# Vivado block design design_3, xczu28dr-ffvg1517-2-e, Vivado 2021.1
# (continued, part 2 of 3)
current_bd_instance /tx1/fec_hier_tx1

create_bd_cell -type ip -vlnv xilinx.com:ip:axis_subset_converter:1.1 axis_subset_converter_2
set_property -dict [list \
  CONFIG.M_TDATA_NUM_BYTES 16 \
  CONFIG.S_TDATA_NUM_BYTES 4 \
  CONFIG.TDATA_REMAP {96'b000000000000000000000000000000000000000000000000000000000000000000000000000000000000000000000000,tdata[31:0]} \
  CONFIG.TKEEP_REMAP {1'b0} \
] [get_bd_cells axis_subset_converter_2]
create_bd_cell -type ip -vlnv xilinx.com:ip:axis_subset_converter:1.1 axis_subset_converter_3
set_property -dict [list \
  CONFIG.M_TDATA_NUM_BYTES 4 \
  CONFIG.S_TDATA_NUM_BYTES 16 \
  CONFIG.TDATA_REMAP {tdata[31:0]} \
  CONFIG.TKEEP_REMAP {1'b0} \
] [get_bd_cells axis_subset_converter_3]
create_bd_cell -type ip -vlnv xilinx.com:ip:sd_fec:1.1 sd_fec_0
set_property -dict [list \
  CONFIG.Build_SDK_Project true \
  CONFIG.DIN_Words 4 \
  CONFIG.DOUT_Words 4 \
  CONFIG.DRV_INITIALIZATION_PARAMS {{ 0x00000014,0x00000001,0x0000000C,0x00000000 }} \
  CONFIG.DRV_STANDARD 1 \
  CONFIG.DRV_TURBO_PARAMS undefined \
  CONFIG.Example_Design_PS_Type ZYNQ_UltraScale+_RFSoC \
  CONFIG.HDL_INITIALIZATION {{20 1 FEC_CODE} {12 0 AXIS_WIDTH}} \
  CONFIG.Include_Encoder true \
  CONFIG.Include_PS_Example_Design true \
  CONFIG.LDPC_Decode false \
  CONFIG.LDPC_Encode true \
  CONFIG.Parameter_Interface Initialized_retain_I/F \
  CONFIG.Standard 5G \
] [get_bd_cells sd_fec_0]
create_bd_cell -type ip -vlnv xilinx.com:ip:axis_broadcaster:1.1 axis_broadcaster_0
create_bd_cell -type ip -vlnv xilinx.com:user:fec_controller:1.0 fec_controller_0
set_property -dict {CONFIG.C_S00_AXIS_TDATA_WIDTH 32} [get_bd_cells fec_controller_0]

# ---- hierarchy /hier_sync_tx ----
current_bd_instance /hier_sync_tx
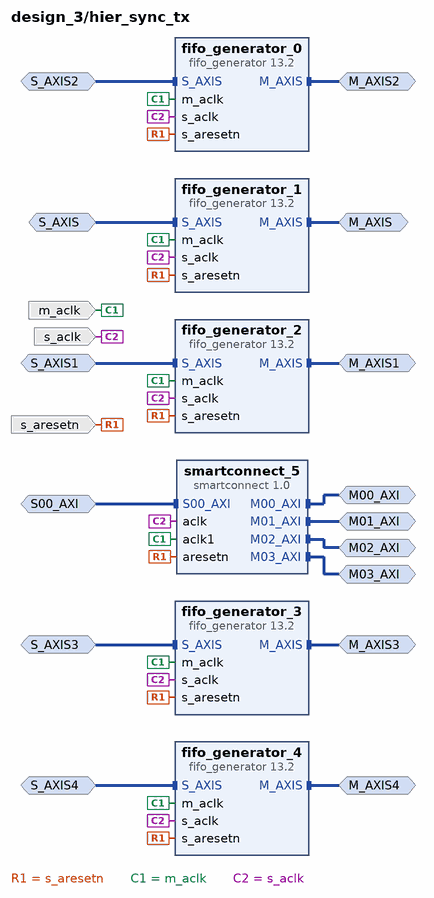
[diagram p15: block diagram inside /hier_sync_tx]
create_bd_intf_pin -mode Master -vlnv xilinx.com:interface:axis_rtl:1.0 M_AXIS
create_bd_intf_pin -mode Slave -vlnv xilinx.com:interface:axis_rtl:1.0 S_AXIS
create_bd_intf_pin -mode Master -vlnv xilinx.com:interface:axis_rtl:1.0 M_AXIS1
create_bd_intf_pin -mode Slave -vlnv xilinx.com:interface:axis_rtl:1.0 S_AXIS1
create_bd_intf_pin -mode Master -vlnv xilinx.com:interface:axis_rtl:1.0 M_AXIS2
create_bd_intf_pin -mode Slave -vlnv xilinx.com:interface:axis_rtl:1.0 S_AXIS2
create_bd_intf_pin -mode Slave -vlnv xilinx.com:interface:axis_rtl:1.0 S_AXIS3
create_bd_intf_pin -mode Slave -vlnv xilinx.com:interface:axis_rtl:1.0 S_AXIS4
create_bd_intf_pin -mode Master -vlnv xilinx.com:interface:axis_rtl:1.0 M_AXIS3
create_bd_intf_pin -mode Master -vlnv xilinx.com:interface:axis_rtl:1.0 M_AXIS4
create_bd_intf_pin -mode Slave -vlnv xilinx.com:interface:aximm_rtl:1.0 S00_AXI
create_bd_intf_pin -mode Master -vlnv xilinx.com:interface:aximm_rtl:1.0 M03_AXI
create_bd_intf_pin -mode Master -vlnv xilinx.com:interface:aximm_rtl:1.0 M00_AXI
create_bd_intf_pin -mode Master -vlnv xilinx.com:interface:aximm_rtl:1.0 M01_AXI
create_bd_intf_pin -mode Master -vlnv xilinx.com:interface:aximm_rtl:1.0 M02_AXI
create_bd_pin -dir I -type clk m_aclk
create_bd_pin -dir I -type clk s_aclk
create_bd_pin -dir I -type rst s_aresetn

create_bd_cell -type ip -vlnv xilinx.com:ip:fifo_generator:13.2 fifo_generator_1
set_property -dict [list \
  CONFIG.Clock_Type_AXI Independent_Clock \
  CONFIG.FIFO_Implementation_axis Independent_Clocks_Builtin_FIFO \
  CONFIG.FIFO_Implementation_rach Independent_Clocks_Distributed_RAM \
  CONFIG.FIFO_Implementation_rdch Independent_Clocks_Builtin_FIFO \
  CONFIG.FIFO_Implementation_wach Independent_Clocks_Distributed_RAM \
  CONFIG.FIFO_Implementation_wdch Independent_Clocks_Builtin_FIFO \
  CONFIG.FIFO_Implementation_wrch Independent_Clocks_Distributed_RAM \
  CONFIG.INTERFACE_TYPE AXI_STREAM \
  CONFIG.TDATA_NUM_BYTES 4 \
] [get_bd_cells fifo_generator_1]
create_bd_cell -type ip -vlnv xilinx.com:ip:fifo_generator:13.2 fifo_generator_2
set_property -dict [list \
  CONFIG.Clock_Type_AXI Independent_Clock \
  CONFIG.Enable_TLAST true \
  CONFIG.FIFO_Implementation_axis Independent_Clocks_Builtin_FIFO \
  CONFIG.FIFO_Implementation_rach Independent_Clocks_Distributed_RAM \
  CONFIG.FIFO_Implementation_rdch Independent_Clocks_Builtin_FIFO \
  CONFIG.FIFO_Implementation_wach Independent_Clocks_Distributed_RAM \
  CONFIG.FIFO_Implementation_wdch Independent_Clocks_Builtin_FIFO \
  CONFIG.FIFO_Implementation_wrch Independent_Clocks_Distributed_RAM \
  CONFIG.INTERFACE_TYPE AXI_STREAM \
  CONFIG.TDATA_NUM_BYTES 4 \
] [get_bd_cells fifo_generator_2]
create_bd_cell -type ip -vlnv xilinx.com:ip:fifo_generator:13.2 fifo_generator_0
set_property -dict [list \
  CONFIG.Clock_Type_AXI Independent_Clock \
  CONFIG.Enable_TLAST true \
  CONFIG.FIFO_Implementation_axis Independent_Clocks_Builtin_FIFO \
  CONFIG.FIFO_Implementation_rach Independent_Clocks_Distributed_RAM \
  CONFIG.FIFO_Implementation_rdch Independent_Clocks_Builtin_FIFO \
  CONFIG.FIFO_Implementation_wach Independent_Clocks_Distributed_RAM \
  CONFIG.FIFO_Implementation_wdch Independent_Clocks_Builtin_FIFO \
  CONFIG.FIFO_Implementation_wrch Independent_Clocks_Distributed_RAM \
  CONFIG.INTERFACE_TYPE AXI_STREAM \
  CONFIG.TDATA_NUM_BYTES 4 \
] [get_bd_cells fifo_generator_0]
create_bd_cell -type ip -vlnv xilinx.com:ip:fifo_generator:13.2 fifo_generator_3
set_property -dict [list \
  CONFIG.Clock_Type_AXI Independent_Clock \
  CONFIG.FIFO_Implementation_axis Independent_Clocks_Builtin_FIFO \
  CONFIG.FIFO_Implementation_rach Independent_Clocks_Distributed_RAM \
  CONFIG.FIFO_Implementation_rdch Independent_Clocks_Builtin_FIFO \
  CONFIG.FIFO_Implementation_wach Independent_Clocks_Distributed_RAM \
  CONFIG.FIFO_Implementation_wdch Independent_Clocks_Builtin_FIFO \
  CONFIG.FIFO_Implementation_wrch Independent_Clocks_Distributed_RAM \
  CONFIG.INTERFACE_TYPE AXI_STREAM \
  CONFIG.TDATA_NUM_BYTES 4 \
] [get_bd_cells fifo_generator_3]
create_bd_cell -type ip -vlnv xilinx.com:ip:fifo_generator:13.2 fifo_generator_4
set_property -dict [list \
  CONFIG.Clock_Type_AXI Independent_Clock \
  CONFIG.FIFO_Implementation_axis Independent_Clocks_Builtin_FIFO \
  CONFIG.FIFO_Implementation_rach Independent_Clocks_Distributed_RAM \
  CONFIG.FIFO_Implementation_rdch Independent_Clocks_Builtin_FIFO \
  CONFIG.FIFO_Implementation_wach Independent_Clocks_Distributed_RAM \
  CONFIG.FIFO_Implementation_wdch Independent_Clocks_Builtin_FIFO \
  CONFIG.FIFO_Implementation_wrch Independent_Clocks_Distributed_RAM \
  CONFIG.INTERFACE_TYPE AXI_STREAM \
  CONFIG.TDATA_NUM_BYTES 4 \
] [get_bd_cells fifo_generator_4]
create_bd_cell -type ip -vlnv xilinx.com:ip:smartconnect:1.0 smartconnect_5
set_property -dict {CONFIG.NUM_CLKS 2 CONFIG.NUM_MI 4 CONFIG.NUM_SI 1} [get_bd_cells smartconnect_5]

# ---- hierarchy /reset_hier ----
current_bd_instance /reset_hier
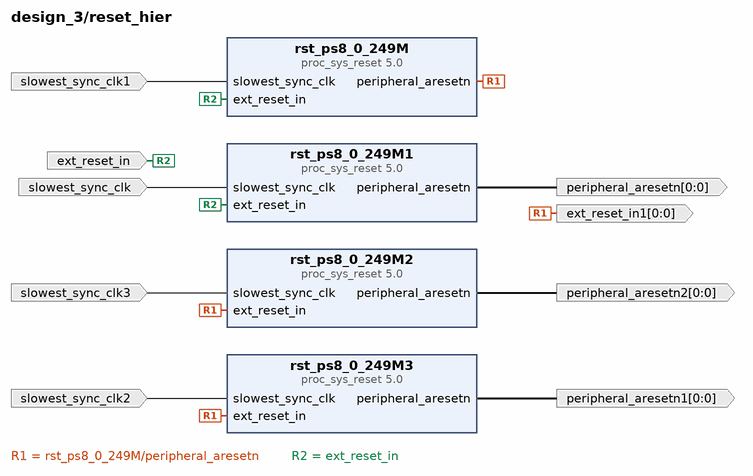
[diagram p16: block diagram inside /reset_hier]
create_bd_pin -dir I -type clk slowest_sync_clk
create_bd_pin -dir I -type rst ext_reset_in
create_bd_pin -dir O -from 0 -to 0 -type rst peripheral_aresetn
create_bd_pin -dir I -type clk slowest_sync_clk1
create_bd_pin -dir O -from 0 -to 0 -type rst ext_reset_in1
create_bd_pin -dir I -type clk slowest_sync_clk2
create_bd_pin -dir O -from 0 -to 0 -type rst peripheral_aresetn1
create_bd_pin -dir I -type clk slowest_sync_clk3
create_bd_pin -dir O -from 0 -to 0 -type rst peripheral_aresetn2

create_bd_cell -type ip -vlnv xilinx.com:ip:proc_sys_reset:5.0 rst_ps8_0_249M1
create_bd_cell -type ip -vlnv xilinx.com:ip:proc_sys_reset:5.0 rst_ps8_0_249M
create_bd_cell -type ip -vlnv xilinx.com:ip:proc_sys_reset:5.0 rst_ps8_0_249M3
create_bd_cell -type ip -vlnv xilinx.com:ip:proc_sys_reset:5.0 rst_ps8_0_249M2

# ---- hierarchy /hier_sync_rx ----
current_bd_instance /hier_sync_rx
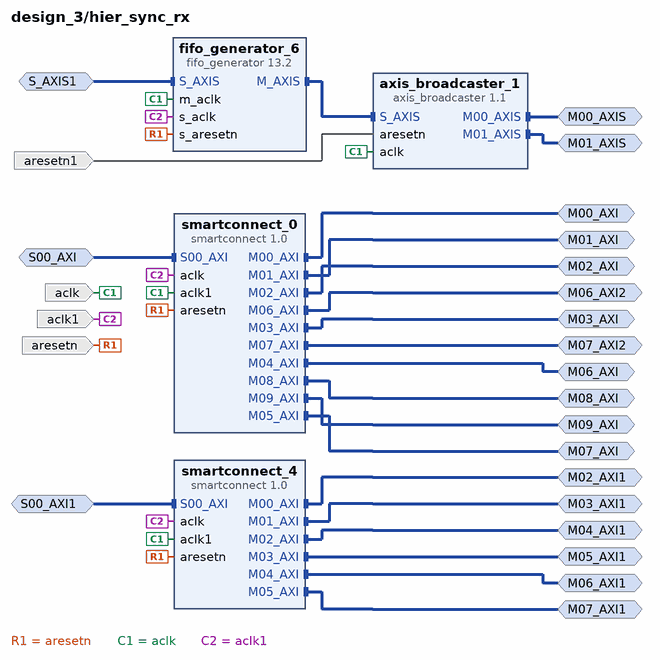
[diagram p17: block diagram inside /hier_sync_rx]
create_bd_intf_pin -mode Slave -vlnv xilinx.com:interface:axis_rtl:1.0 S_AXIS1
create_bd_intf_pin -mode Slave -vlnv xilinx.com:interface:aximm_rtl:1.0 S00_AXI
create_bd_intf_pin -mode Master -vlnv xilinx.com:interface:aximm_rtl:1.0 M00_AXI
create_bd_intf_pin -mode Master -vlnv xilinx.com:interface:aximm_rtl:1.0 M01_AXI
create_bd_intf_pin -mode Master -vlnv xilinx.com:interface:aximm_rtl:1.0 M02_AXI
create_bd_intf_pin -mode Master -vlnv xilinx.com:interface:aximm_rtl:1.0 M03_AXI
create_bd_intf_pin -mode Master -vlnv xilinx.com:interface:aximm_rtl:1.0 M06_AXI
create_bd_intf_pin -mode Master -vlnv xilinx.com:interface:aximm_rtl:1.0 M07_AXI
create_bd_intf_pin -mode Slave -vlnv xilinx.com:interface:aximm_rtl:1.0 S00_AXI1
create_bd_intf_pin -mode Master -vlnv xilinx.com:interface:aximm_rtl:1.0 M02_AXI1
create_bd_intf_pin -mode Master -vlnv xilinx.com:interface:aximm_rtl:1.0 M03_AXI1
create_bd_intf_pin -mode Master -vlnv xilinx.com:interface:aximm_rtl:1.0 M04_AXI1
create_bd_intf_pin -mode Master -vlnv xilinx.com:interface:aximm_rtl:1.0 M05_AXI1
create_bd_intf_pin -mode Master -vlnv xilinx.com:interface:aximm_rtl:1.0 M06_AXI1
create_bd_intf_pin -mode Master -vlnv xilinx.com:interface:aximm_rtl:1.0 M07_AXI1
create_bd_intf_pin -mode Master -vlnv xilinx.com:interface:axis_rtl:1.0 M00_AXIS
create_bd_intf_pin -mode Master -vlnv xilinx.com:interface:axis_rtl:1.0 M01_AXIS
create_bd_intf_pin -mode Master -vlnv xilinx.com:interface:aximm_rtl:1.0 M06_AXI2
create_bd_intf_pin -mode Master -vlnv xilinx.com:interface:aximm_rtl:1.0 M07_AXI2
create_bd_intf_pin -mode Master -vlnv xilinx.com:interface:aximm_rtl:1.0 M08_AXI
create_bd_intf_pin -mode Master -vlnv xilinx.com:interface:aximm_rtl:1.0 M09_AXI
create_bd_pin -dir I -type clk aclk
create_bd_pin -dir I -type clk aclk1
create_bd_pin -dir I -type rst aresetn
create_bd_pin -dir I -type rst aresetn1

create_bd_cell -type ip -vlnv xilinx.com:ip:fifo_generator:13.2 fifo_generator_6
set_property -dict [list \
  CONFIG.Clock_Type_AXI Independent_Clock \
  CONFIG.Enable_TLAST true \
  CONFIG.FIFO_Implementation_axis Independent_Clocks_Builtin_FIFO \
  CONFIG.FIFO_Implementation_rach Independent_Clocks_Distributed_RAM \
  CONFIG.FIFO_Implementation_rdch Independent_Clocks_Builtin_FIFO \
  CONFIG.FIFO_Implementation_wach Independent_Clocks_Distributed_RAM \
  CONFIG.FIFO_Implementation_wdch Independent_Clocks_Builtin_FIFO \
  CONFIG.FIFO_Implementation_wrch Independent_Clocks_Distributed_RAM \
  CONFIG.INTERFACE_TYPE AXI_STREAM \
  CONFIG.TDATA_NUM_BYTES 4 \
] [get_bd_cells fifo_generator_6]
create_bd_cell -type ip -vlnv xilinx.com:ip:smartconnect:1.0 smartconnect_0
set_property -dict {CONFIG.NUM_CLKS 2 CONFIG.NUM_MI 10 CONFIG.NUM_SI 1} [get_bd_cells smartconnect_0]
create_bd_cell -type ip -vlnv xilinx.com:ip:smartconnect:1.0 smartconnect_4
set_property -dict {CONFIG.NUM_CLKS 2 CONFIG.NUM_MI 6 CONFIG.NUM_SI 1} [get_bd_cells smartconnect_4]
create_bd_cell -type ip -vlnv xilinx.com:ip:axis_broadcaster:1.1 axis_broadcaster_1
set_property -dict {CONFIG.HAS_TLAST 1} [get_bd_cells axis_broadcaster_1]

# ---- connections ----

current_bd_instance /dmas_rx
connect_bd_intf_net [get_bd_intf_pins S_AXIS] [get_bd_intf_pins fifo_generator_2/S_AXIS]
connect_bd_intf_net [get_bd_intf_pins S_AXIS1] [get_bd_intf_pins fifo_generator_9/S_AXIS]
connect_bd_intf_net [get_bd_intf_pins M_AXI_S2MM] [get_bd_intf_pins axi_dma_4/M_AXI_S2MM]
connect_bd_intf_net [get_bd_intf_pins M_AXI_SG] [get_bd_intf_pins axi_dma_4/M_AXI_SG]
connect_bd_intf_net [get_bd_intf_pins M_AXI_S2MM1] [get_bd_intf_pins axi_dma_5/M_AXI_S2MM]
connect_bd_intf_net [get_bd_intf_pins M_AXI_SG1] [get_bd_intf_pins axi_dma_5/M_AXI_SG]
connect_bd_intf_net [get_bd_intf_pins axi_dma_5/S_AXIS_S2MM] [get_bd_intf_pins fifo_generator_2/M_AXIS]
connect_bd_intf_net [get_bd_intf_pins axi_dma_4/S_AXIS_S2MM] [get_bd_intf_pins fifo_generator_9/M_AXIS]
connect_bd_intf_net [get_bd_intf_pins S_AXI_LITE] [get_bd_intf_pins axi_dma_4/S_AXI_LITE]
connect_bd_intf_net [get_bd_intf_pins S_AXI_LITE1] [get_bd_intf_pins axi_dma_5/S_AXI_LITE]
connect_bd_net [get_bd_pins axi_dma_4/s2mm_introut] [get_bd_pins s2mm_introut]
connect_bd_net [get_bd_pins axi_dma_5/s2mm_introut] [get_bd_pins s2mm_introut1]
connect_bd_net -net rst_ps8_0_249M_peripheral_aresetn [get_bd_pins axi_resetn] [get_bd_pins axi_dma_5/axi_resetn] [get_bd_pins axi_dma_4/axi_resetn]
connect_bd_net [get_bd_pins s_aclk] [get_bd_pins fifo_generator_2/s_aclk] [get_bd_pins fifo_generator_9/s_aclk]
connect_bd_net [get_bd_pins s_aresetn] [get_bd_pins fifo_generator_2/s_aresetn] [get_bd_pins fifo_generator_9/s_aresetn]
connect_bd_net -net zynq_ultra_ps_e_0_pl_clk0 [get_bd_pins m_axi_s2mm_aclk] \
  [get_bd_pins axi_dma_4/m_axi_s2mm_aclk] [get_bd_pins axi_dma_4/m_axi_sg_aclk] [get_bd_pins axi_dma_5/m_axi_s2mm_aclk] \
  [get_bd_pins axi_dma_5/m_axi_sg_aclk] [get_bd_pins axi_dma_5/s_axi_lite_aclk] [get_bd_pins axi_dma_4/s_axi_lite_aclk] \
  [get_bd_pins fifo_generator_2/m_aclk] [get_bd_pins fifo_generator_9/m_aclk]

current_bd_instance /dmas_tx
connect_bd_intf_net [get_bd_intf_pins M_AXIS_MM2S6] [get_bd_intf_pins axi_dma_0/M_AXIS_MM2S]
connect_bd_intf_net [get_bd_intf_pins M_AXI_MM2S6] [get_bd_intf_pins axi_dma_0/M_AXI_MM2S]
connect_bd_intf_net [get_bd_intf_pins M_AXI_SG6] [get_bd_intf_pins axi_dma_0/M_AXI_SG]
connect_bd_intf_net [get_bd_intf_pins M_AXIS_MM2S] [get_bd_intf_pins axi_dma_1/M_AXIS_MM2S]
connect_bd_intf_net [get_bd_intf_pins M_AXI_MM2S] [get_bd_intf_pins axi_dma_1/M_AXI_MM2S]
connect_bd_intf_net [get_bd_intf_pins M_AXI_SG] [get_bd_intf_pins axi_dma_1/M_AXI_SG]
connect_bd_intf_net [get_bd_intf_pins M_AXIS_MM2S1] [get_bd_intf_pins axi_dma_2/M_AXIS_MM2S]
connect_bd_intf_net [get_bd_intf_pins M_AXI_MM2S1] [get_bd_intf_pins axi_dma_2/M_AXI_MM2S]
connect_bd_intf_net [get_bd_intf_pins M_AXI_SG1] [get_bd_intf_pins axi_dma_2/M_AXI_SG]
connect_bd_intf_net [get_bd_intf_pins M_AXIS_MM2S2] [get_bd_intf_pins axi_dma_3/M_AXIS_MM2S]
connect_bd_intf_net [get_bd_intf_pins M_AXI_MM2S2] [get_bd_intf_pins axi_dma_3/M_AXI_MM2S]
connect_bd_intf_net [get_bd_intf_pins M_AXI_SG2] [get_bd_intf_pins axi_dma_3/M_AXI_SG]
connect_bd_intf_net [get_bd_intf_pins M_AXIS_MM2S3] [get_bd_intf_pins axi_dma_6/M_AXIS_MM2S]
connect_bd_intf_net [get_bd_intf_pins M_AXI_MM2S3] [get_bd_intf_pins axi_dma_6/M_AXI_MM2S]
connect_bd_intf_net [get_bd_intf_pins M_AXI_SG3] [get_bd_intf_pins axi_dma_6/M_AXI_SG]
connect_bd_intf_net [get_bd_intf_pins M_AXI_MM2S4] [get_bd_intf_pins axi_dma_7/M_AXI_MM2S]
connect_bd_intf_net [get_bd_intf_pins M_AXI_SG4] [get_bd_intf_pins axi_dma_7/M_AXI_SG]
connect_bd_intf_net [get_bd_intf_pins S_AXI_LITE6] [get_bd_intf_pins axi_dma_0/S_AXI_LITE]
connect_bd_intf_net [get_bd_intf_pins S_AXI_LITE] [get_bd_intf_pins axi_dma_1/S_AXI_LITE]
connect_bd_intf_net [get_bd_intf_pins S_AXI_LITE1] [get_bd_intf_pins axi_dma_2/S_AXI_LITE]
connect_bd_intf_net [get_bd_intf_pins S_AXI_LITE2] [get_bd_intf_pins axi_dma_3/S_AXI_LITE]
connect_bd_intf_net [get_bd_intf_pins S_AXI_LITE3] [get_bd_intf_pins axi_dma_6/S_AXI_LITE]
connect_bd_intf_net [get_bd_intf_pins S_AXI_LITE4] [get_bd_intf_pins axi_dma_7/S_AXI_LITE]
connect_bd_intf_net [get_bd_intf_pins M_AXIS_MM2S4] [get_bd_intf_pins axi_dma_7/M_AXIS_MM2S]
connect_bd_net [get_bd_pins axi_dma_0/mm2s_introut] [get_bd_pins mm2s_introut6]
connect_bd_net [get_bd_pins axi_dma_1/mm2s_introut] [get_bd_pins mm2s_introut]
connect_bd_net [get_bd_pins axi_dma_2/mm2s_introut] [get_bd_pins mm2s_introut1]
connect_bd_net [get_bd_pins axi_dma_3/mm2s_introut] [get_bd_pins mm2s_introut2]
connect_bd_net [get_bd_pins axi_dma_6/mm2s_introut] [get_bd_pins mm2s_introut3]
connect_bd_net [get_bd_pins axi_dma_7/mm2s_introut] [get_bd_pins mm2s_introut4]
connect_bd_net -net rst_ps8_0_249M_peripheral_aresetn [get_bd_pins axi_resetn] \
  [get_bd_pins axi_dma_0/axi_resetn] [get_bd_pins axi_dma_2/axi_resetn] [get_bd_pins axi_dma_3/axi_resetn] \
  [get_bd_pins axi_dma_6/axi_resetn] [get_bd_pins axi_dma_7/axi_resetn] [get_bd_pins axi_dma_1/axi_resetn]
connect_bd_net -net zynq_ultra_ps_e_0_pl_clk0 [get_bd_pins m_axi_mm2s_aclk] \
  [get_bd_pins axi_dma_0/m_axi_mm2s_aclk] [get_bd_pins axi_dma_0/m_axi_sg_aclk] [get_bd_pins axi_dma_0/s_axi_lite_aclk] \
  [get_bd_pins axi_dma_1/m_axi_mm2s_aclk] [get_bd_pins axi_dma_1/m_axi_sg_aclk] [get_bd_pins axi_dma_2/m_axi_sg_aclk] \
  [get_bd_pins axi_dma_2/s_axi_lite_aclk] [get_bd_pins axi_dma_3/m_axi_mm2s_aclk] [get_bd_pins axi_dma_3/m_axi_sg_aclk] \
  [get_bd_pins axi_dma_3/s_axi_lite_aclk] [get_bd_pins axi_dma_6/s_axi_lite_aclk] [get_bd_pins axi_dma_6/m_axi_sg_aclk] \
  [get_bd_pins axi_dma_6/m_axi_mm2s_aclk] [get_bd_pins axi_dma_7/m_axi_mm2s_aclk] [get_bd_pins axi_dma_7/m_axi_sg_aclk] \
  [get_bd_pins axi_dma_7/s_axi_lite_aclk] [get_bd_pins axi_dma_1/s_axi_lite_aclk] [get_bd_pins axi_dma_2/m_axi_mm2s_aclk]

current_bd_instance /rx0
connect_bd_intf_net [get_bd_intf_pins S_AXIS1] [get_bd_intf_pins correlator/S_AXIS1]
connect_bd_intf_net [get_bd_intf_pins s_axi_tlast1] [get_bd_intf_pins tlast_generator_0/s_axi]
connect_bd_intf_net [get_bd_intf_pins s_axi1] [get_bd_intf_pins zf_equalizer_0/s_axi]
connect_bd_intf_net [get_bd_intf_pins s_axi] [get_bd_intf_pins OFDM_demodulator_0/s_axi]
connect_bd_intf_net [get_bd_intf_pins OFDM_demodulator_0/m00_axis] [get_bd_intf_pins fec_hier_rx0/S_AXIS_DIN]
connect_bd_intf_net [get_bd_intf_pins axis_broadcaster_0/M00_AXIS] [get_bd_intf_pins correlator/s00_axis]
connect_bd_intf_net [get_bd_intf_pins axis_broadcaster_0/M01_AXIS] [get_bd_intf_pins correlator/S_AXIS]
connect_bd_intf_net [get_bd_intf_pins axis_broadcaster_0/M02_AXIS] [get_bd_intf_pins synchronizer_0/s_axis]
connect_bd_intf_net [get_bd_intf_pins axis_broadcaster_2/M01_AXIS] [get_bd_intf_pins synchronizer_0/s_axis_corr_1]
connect_bd_intf_net [get_bd_intf_pins cfo_estimator_0/m_axis] [get_bd_intf_pins ssr_FFT_0/s00_axis]
connect_bd_intf_net [get_bd_intf_pins correlator/M_AXIS] [get_bd_intf_pins axis_broadcaster_2/S_AXIS]
connect_bd_intf_net [get_bd_intf_pins correlator/M_AXIS1] [get_bd_intf_pins synchronizer_0/s_axis_corr_2]
connect_bd_intf_net [get_bd_intf_pins fec_hier_rx0/M_AXIS1] [get_bd_intf_pins tlast_generator_0/s00_axis]
connect_bd_intf_net [get_bd_intf_pins S_AXIS] [get_bd_intf_pins axis_broadcaster_0/S_AXIS]
connect_bd_intf_net [get_bd_intf_pins s_axi_fec] [get_bd_intf_pins fec_hier_rx0/s_axi_fec]
connect_bd_intf_net [get_bd_intf_pins s_axi_fec_ctrl] [get_bd_intf_pins fec_hier_rx0/s_axi_fec_ctrl]
connect_bd_intf_net [get_bd_intf_pins ssr_FFT_0/m00_axis] [get_bd_intf_pins zf_equalizer_0/s_axis]
connect_bd_intf_net [get_bd_intf_pins synchronizer_0/m_axis] [get_bd_intf_pins cfo_estimator_0/s_axis]
connect_bd_intf_net [get_bd_intf_pins m00_axis] [get_bd_intf_pins tlast_generator_0/m00_axis]
connect_bd_intf_net [get_bd_intf_pins zf_equalizer_0/m_axis] [get_bd_intf_pins OFDM_demodulator_0/s00_axis]
connect_bd_net [get_bd_pins aresetn] \
  [get_bd_pins axis_broadcaster_0/aresetn] [get_bd_pins correlator/axis_aresetn] [get_bd_pins axis_broadcaster_2/aresetn] \
  [get_bd_pins tlast_generator_0/axis_aresetn] [get_bd_pins OFDM_demodulator_0/axis_aresetn] \
  [get_bd_pins zf_equalizer_0/s_axi_aresetn] [get_bd_pins cfo_estimator_0/aresetn] [get_bd_pins synchronizer_0/resetn] \
  [get_bd_pins fec_hier_rx0/aresetn] [get_bd_pins ssr_FFT_0/axis_aresetn]
connect_bd_net [get_bd_pins core_clk] [get_bd_pins fec_hier_rx0/core_clk]
connect_bd_net -net zynq_ultra_ps_e_0_pl_clk0 [get_bd_pins aclk] \
  [get_bd_pins axis_broadcaster_0/aclk] [get_bd_pins correlator/axis_aclk] [get_bd_pins axis_broadcaster_2/aclk] \
  [get_bd_pins tlast_generator_0/axis_aclk] [get_bd_pins OFDM_demodulator_0/axis_aclk] \
  [get_bd_pins zf_equalizer_0/s_axi_aclk] [get_bd_pins cfo_estimator_0/clk] [get_bd_pins cfo_estimator_0/clk_fast] \
  [get_bd_pins synchronizer_0/clk] [get_bd_pins fec_hier_rx0/aclk] [get_bd_pins ssr_FFT_0/axis_aclk]

current_bd_instance /rx0/correlator
connect_bd_intf_net [get_bd_intf_pins S_AXIS1] [get_bd_intf_pins axis_broadcaster_1/S_AXIS]
connect_bd_intf_net [get_bd_intf_pins OFDM_correlator_0/m00_axis] [get_bd_intf_pins ssr_IFFT_2/s00_axis]
connect_bd_intf_net [get_bd_intf_pins OFDM_correlator_1/m00_axis] [get_bd_intf_pins ssr_IFFT_1/s00_axis]
connect_bd_intf_net [get_bd_intf_pins s00_axis] [get_bd_intf_pins ssr_FFT_0/s00_axis]
connect_bd_intf_net [get_bd_intf_pins S_AXIS] [get_bd_intf_pins fifo_generator_0/S_AXIS]
connect_bd_intf_net [get_bd_intf_pins axis_broadcaster_1/M00_AXIS] [get_bd_intf_pins OFDM_correlator_0/s00_axis_config]
connect_bd_intf_net [get_bd_intf_pins axis_broadcaster_1/M01_AXIS] [get_bd_intf_pins OFDM_correlator_1/s00_axis_config]
connect_bd_intf_net [get_bd_intf_pins delay_0/m00_axis] [get_bd_intf_pins ssr_FFT_1/s00_axis]
connect_bd_intf_net [get_bd_intf_pins delay_0/s00_axis] [get_bd_intf_pins fifo_generator_0/M_AXIS]
connect_bd_intf_net [get_bd_intf_pins ssr_FFT_0/m00_axis] [get_bd_intf_pins OFDM_correlator_1/s00_axis]
connect_bd_intf_net [get_bd_intf_pins ssr_FFT_1/m00_axis] [get_bd_intf_pins OFDM_correlator_0/s00_axis]
connect_bd_intf_net [get_bd_intf_pins M_AXIS] [get_bd_intf_pins ssr_IFFT_1/m00_axis]
connect_bd_intf_net [get_bd_intf_pins M_AXIS1] [get_bd_intf_pins ssr_IFFT_2/m00_axis]
connect_bd_net -net rst_ps8_0_249M_peripheral_aresetn [get_bd_pins axis_aresetn] \
  [get_bd_pins axis_broadcaster_1/aresetn] [get_bd_pins fifo_generator_0/s_aresetn] [get_bd_pins delay_0/axis_aresetn] \
  [get_bd_pins ssr_IFFT_1/s_axis_aresetn] [get_bd_pins ssr_IFFT_2/s_axis_aresetn] [get_bd_pins OFDM_correlator_0/resetn] \
  [get_bd_pins OFDM_correlator_1/resetn] [get_bd_pins ssr_FFT_0/axis_aresetn] [get_bd_pins ssr_FFT_1/axis_aresetn]
connect_bd_net -net zynq_ultra_ps_e_0_pl_clk0 [get_bd_pins axis_aclk] \
  [get_bd_pins axis_broadcaster_1/aclk] [get_bd_pins fifo_generator_0/s_aclk] [get_bd_pins delay_0/axis_aclk] \
  [get_bd_pins ssr_IFFT_1/s_axis_aclk] [get_bd_pins ssr_IFFT_2/s_axis_aclk] [get_bd_pins OFDM_correlator_0/clk] \
  [get_bd_pins OFDM_correlator_1/clk] [get_bd_pins ssr_FFT_0/axis_aclk] [get_bd_pins ssr_FFT_1/axis_aclk]

current_bd_instance /rx0/fec_hier_rx0
connect_bd_intf_net [get_bd_intf_pins S_AXIS_DIN] [get_bd_intf_pins axis_broadcaster_4/S_AXIS]
connect_bd_intf_net [get_bd_intf_pins axis_broadcaster_4/M00_AXIS] [get_bd_intf_pins fec_controller_0/s00_axis]
connect_bd_intf_net [get_bd_intf_pins axis_broadcaster_4/M01_AXIS] [get_bd_intf_pins sd_fec_1/S_AXIS_DIN]
connect_bd_intf_net [get_bd_intf_pins fec_controller_0/m00_axis] [get_bd_intf_pins sd_fec_1/S_AXIS_CTRL]
connect_bd_intf_net [get_bd_intf_pins s_axi_fec] [get_bd_intf_pins sd_fec_1/S_AXI]
connect_bd_intf_net [get_bd_intf_pins s_axi_fec_ctrl] [get_bd_intf_pins fec_controller_0/s_axi]
connect_bd_intf_net [get_bd_intf_pins M_AXIS1] [get_bd_intf_pins sd_fec_1/M_AXIS_DOUT]
connect_bd_net -net aresetn1_1 [get_bd_pins aresetn] \
  [get_bd_pins axis_broadcaster_4/aresetn] [get_bd_pins sd_fec_1/reset_n] [get_bd_pins fec_controller_0/axis_aresetn]
connect_bd_net [get_bd_pins core_clk] [get_bd_pins sd_fec_1/core_clk]
connect_bd_net -net m_axis_aclk_1 [get_bd_pins aclk] \
  [get_bd_pins axis_broadcaster_4/aclk] [get_bd_pins sd_fec_1/s_axi_aclk] [get_bd_pins sd_fec_1/s_axis_ctrl_aclk] \
  [get_bd_pins sd_fec_1/s_axis_din_aclk] [get_bd_pins sd_fec_1/m_axis_status_aclk] [get_bd_pins sd_fec_1/m_axis_dout_aclk] \
  [get_bd_pins fec_controller_0/axis_aclk]

current_bd_instance /rx1
connect_bd_intf_net [get_bd_intf_pins S_AXIS1] [get_bd_intf_pins correlator/S_AXIS1]
connect_bd_intf_net [get_bd_intf_pins s_axi1] [get_bd_intf_pins zf_equalizer_0/s_axi]
connect_bd_intf_net [get_bd_intf_pins s_axi_tlast0] [get_bd_intf_pins tlast_generator_0/s_axi]
connect_bd_intf_net [get_bd_intf_pins s_axi] [get_bd_intf_pins OFDM_demodulator_0/s_axi]
connect_bd_intf_net [get_bd_intf_pins OFDM_demodulator_0/m00_axis] [get_bd_intf_pins fec_hier_rx1/S_AXIS_DIN]
connect_bd_intf_net [get_bd_intf_pins axis_broadcaster_0/M00_AXIS] [get_bd_intf_pins correlator/s00_axis]
connect_bd_intf_net [get_bd_intf_pins axis_broadcaster_0/M01_AXIS] [get_bd_intf_pins correlator/S_AXIS]
connect_bd_intf_net [get_bd_intf_pins synchronizer_0/s_axis] [get_bd_intf_pins axis_broadcaster_0/M02_AXIS]
connect_bd_intf_net [get_bd_intf_pins cfo_estimator_0/m_axis] [get_bd_intf_pins ssr_FFT_0/s00_axis]
connect_bd_intf_net [get_bd_intf_pins cfo_estimator_0/m_axis] [get_bd_intf_pins m_axis2]
connect_bd_intf_net [get_bd_intf_pins synchronizer_0/s_axis_corr_1] [get_bd_intf_pins correlator/M_AXIS]
connect_bd_intf_net [get_bd_intf_pins synchronizer_0/s_axis_corr_2] [get_bd_intf_pins correlator/M_AXIS1]
connect_bd_intf_net [get_bd_intf_pins fec_hier_rx1/M_AXIS1] [get_bd_intf_pins tlast_generator_0/s00_axis]
connect_bd_intf_net [get_bd_intf_pins S_AXIS] [get_bd_intf_pins axis_broadcaster_0/S_AXIS]
connect_bd_intf_net [get_bd_intf_pins OFDM_demodulator_0/s00_axis] [get_bd_intf_pins zf_equalizer_0/m_axis]
connect_bd_intf_net [get_bd_intf_pins OFDM_demodulator_0/s00_axis] [get_bd_intf_pins s00_axis]
connect_bd_intf_net [get_bd_intf_pins s_axi_fec] [get_bd_intf_pins fec_hier_rx1/s_axi_fec]
connect_bd_intf_net [get_bd_intf_pins s_axi_fec_ctrl] [get_bd_intf_pins fec_hier_rx1/s_axi_fec_ctrl]
connect_bd_intf_net [get_bd_intf_pins ssr_FFT_0/m00_axis] [get_bd_intf_pins zf_equalizer_0/s_axis]
connect_bd_intf_net [get_bd_intf_pins ssr_FFT_0/m00_axis] [get_bd_intf_pins m00_axis]
connect_bd_intf_net [get_bd_intf_pins synchronizer_0/m_axis] [get_bd_intf_pins cfo_estimator_0/s_axis]
connect_bd_intf_net [get_bd_intf_pins synchronizer_0/m_axis] [get_bd_intf_pins m_axis1]
connect_bd_intf_net [get_bd_intf_pins M_AXIS] [get_bd_intf_pins tlast_generator_0/m00_axis]
connect_bd_net [get_bd_pins core_clk] [get_bd_pins fec_hier_rx1/core_clk]
connect_bd_net -net rst_ps8_0_249M_peripheral_aresetn [get_bd_pins aresetn] \
  [get_bd_pins axis_broadcaster_0/aresetn] [get_bd_pins correlator/axis_aresetn] [get_bd_pins tlast_generator_0/axis_aresetn] \
  [get_bd_pins fec_hier_rx1/aresetn] [get_bd_pins OFDM_demodulator_0/axis_aresetn] [get_bd_pins zf_equalizer_0/s_axi_aresetn] \
  [get_bd_pins cfo_estimator_0/aresetn] [get_bd_pins synchronizer_0/resetn] [get_bd_pins ssr_FFT_0/axis_aresetn]
connect_bd_net -net zynq_ultra_ps_e_0_pl_clk0 [get_bd_pins aclk] \
  [get_bd_pins axis_broadcaster_0/aclk] [get_bd_pins correlator/axis_aclk] [get_bd_pins tlast_generator_0/axis_aclk] \
  [get_bd_pins fec_hier_rx1/aclk] [get_bd_pins OFDM_demodulator_0/axis_aclk] [get_bd_pins zf_equalizer_0/s_axi_aclk] \
  [get_bd_pins cfo_estimator_0/clk] [get_bd_pins cfo_estimator_0/clk_fast] [get_bd_pins synchronizer_0/clk] \
  [get_bd_pins ssr_FFT_0/axis_aclk]

current_bd_instance /rx1/correlator
connect_bd_intf_net [get_bd_intf_pins S_AXIS1] [get_bd_intf_pins axis_broadcaster_1/S_AXIS]
connect_bd_intf_net [get_bd_intf_pins OFDM_correlator_0/m00_axis] [get_bd_intf_pins ssr_IFFT_1/s00_axis]
connect_bd_intf_net [get_bd_intf_pins OFDM_correlator_1/m00_axis] [get_bd_intf_pins ssr_IFFT_2/s00_axis]
connect_bd_intf_net [get_bd_intf_pins s00_axis] [get_bd_intf_pins ssr_FFT_0/s00_axis]
connect_bd_intf_net [get_bd_intf_pins S_AXIS] [get_bd_intf_pins fifo_generator_0/S_AXIS]
connect_bd_intf_net [get_bd_intf_pins OFDM_correlator_0/s00_axis_config] [get_bd_intf_pins axis_broadcaster_1/M00_AXIS]
connect_bd_intf_net [get_bd_intf_pins OFDM_correlator_1/s00_axis_config] [get_bd_intf_pins axis_broadcaster_1/M01_AXIS]
connect_bd_intf_net [get_bd_intf_pins delay_0/m00_axis] [get_bd_intf_pins ssr_FFT_1/s00_axis]
connect_bd_intf_net [get_bd_intf_pins delay_0/s00_axis] [get_bd_intf_pins fifo_generator_0/M_AXIS]
connect_bd_intf_net [get_bd_intf_pins ssr_FFT_0/m00_axis] [get_bd_intf_pins OFDM_correlator_0/s00_axis]
connect_bd_intf_net [get_bd_intf_pins OFDM_correlator_1/s00_axis] [get_bd_intf_pins ssr_FFT_1/m00_axis]
connect_bd_intf_net [get_bd_intf_pins M_AXIS] [get_bd_intf_pins ssr_IFFT_1/m00_axis]
connect_bd_intf_net [get_bd_intf_pins M_AXIS1] [get_bd_intf_pins ssr_IFFT_2/m00_axis]
connect_bd_net -net rst_ps8_0_249M_peripheral_aresetn [get_bd_pins axis_aresetn] \
  [get_bd_pins axis_broadcaster_1/aresetn] [get_bd_pins fifo_generator_0/s_aresetn] [get_bd_pins delay_0/axis_aresetn] \
  [get_bd_pins ssr_IFFT_1/s_axis_aresetn] [get_bd_pins ssr_IFFT_2/s_axis_aresetn] [get_bd_pins OFDM_correlator_0/resetn] \
  [get_bd_pins OFDM_correlator_1/resetn] [get_bd_pins ssr_FFT_0/axis_aresetn] [get_bd_pins ssr_FFT_1/axis_aresetn]
connect_bd_net -net zynq_ultra_ps_e_0_pl_clk0 [get_bd_pins axis_aclk] \
  [get_bd_pins axis_broadcaster_1/aclk] [get_bd_pins fifo_generator_0/s_aclk] [get_bd_pins delay_0/axis_aclk] \
  [get_bd_pins ssr_IFFT_1/s_axis_aclk] [get_bd_pins ssr_IFFT_2/s_axis_aclk] [get_bd_pins OFDM_correlator_0/clk] \
  [get_bd_pins OFDM_correlator_1/clk] [get_bd_pins ssr_FFT_0/axis_aclk] [get_bd_pins ssr_FFT_1/axis_aclk]

current_bd_instance /rx1/fec_hier_rx1
connect_bd_intf_net [get_bd_intf_pins S_AXIS_DIN] [get_bd_intf_pins axis_broadcaster_4/S_AXIS]
connect_bd_intf_net [get_bd_intf_pins axis_broadcaster_4/M00_AXIS] [get_bd_intf_pins fec_controller_0/s00_axis]
connect_bd_intf_net [get_bd_intf_pins axis_broadcaster_4/M01_AXIS] [get_bd_intf_pins sd_fec_1/S_AXIS_DIN]
connect_bd_intf_net [get_bd_intf_pins fec_controller_0/m00_axis] [get_bd_intf_pins sd_fec_1/S_AXIS_CTRL]
connect_bd_intf_net [get_bd_intf_pins s_axi_fec] [get_bd_intf_pins sd_fec_1/S_AXI]
connect_bd_intf_net [get_bd_intf_pins s_axi_fec_ctrl] [get_bd_intf_pins fec_controller_0/s_axi]
connect_bd_intf_net [get_bd_intf_pins M_AXIS1] [get_bd_intf_pins sd_fec_1/M_AXIS_DOUT]
connect_bd_net -net aresetn1_1 [get_bd_pins aresetn] \
  [get_bd_pins axis_broadcaster_4/aresetn] [get_bd_pins sd_fec_1/reset_n] [get_bd_pins fec_controller_0/axis_aresetn]
connect_bd_net [get_bd_pins core_clk] [get_bd_pins sd_fec_1/core_clk]
connect_bd_net -net m_axis_aclk_1 [get_bd_pins aclk] \
  [get_bd_pins axis_broadcaster_4/aclk] [get_bd_pins sd_fec_1/s_axi_aclk] [get_bd_pins sd_fec_1/s_axis_ctrl_aclk] \
  [get_bd_pins sd_fec_1/s_axis_din_aclk] [get_bd_pins sd_fec_1/m_axis_status_aclk] [get_bd_pins sd_fec_1/m_axis_dout_aclk] \
  [get_bd_pins fec_controller_0/axis_aclk]

current_bd_instance /tx0
connect_bd_intf_net [get_bd_intf_pins s_axis_config] [get_bd_intf_pins OFDM_Framer_0/s_axis_config]
connect_bd_intf_net [get_bd_intf_pins s_axi_fec_ctrl] [get_bd_intf_pins fec_hier_tx0/s_axi]
connect_bd_intf_net [get_bd_intf_pins s_axis_framer_ctrl] [get_bd_intf_pins OFDM_Framer_0/s_axis_ctrl]
connect_bd_intf_net [get_bd_intf_pins OFDM_Framer_0/m_axis_data] [get_bd_intf_pins ssr_IFFT_0/s00_axis]
connect_bd_intf_net [get_bd_intf_pins OFDM_Framer_0/m_axis_data] [get_bd_intf_pins m_axis_data]
connect_bd_intf_net [get_bd_intf_pins s_axi_fec] [get_bd_intf_pins fec_hier_tx0/S_AXI_FEC]
connect_bd_intf_net [get_bd_intf_pins OFDM_Framer_0/s_axis_data] [get_bd_intf_pins fec_hier_tx0/M_AXIS]
connect_bd_intf_net [get_bd_intf_pins OFDM_Framer_0/s_axis_data] [get_bd_intf_pins s_axis_data]
connect_bd_intf_net [get_bd_intf_pins s_axis_fec_in] [get_bd_intf_pins fec_hier_tx0/s_axis_fec_in]
connect_bd_intf_net [get_bd_intf_pins m00_axis] [get_bd_intf_pins ssr_IFFT_0/m00_axis]
connect_bd_intf_net [get_bd_intf_pins m00_axis] [get_bd_intf_pins m00_axis1]
connect_bd_net [get_bd_pins core_clk] [get_bd_pins fec_hier_tx0/core_clk]
connect_bd_net -net rst_ps8_0_249M_peripheral_aresetn [get_bd_pins axi_resetn] \
  [get_bd_pins OFDM_Framer_0/axis_aresetn] [get_bd_pins fec_hier_tx0/axi_resetn] [get_bd_pins ssr_IFFT_0/s_axis_aresetn]
connect_bd_net -net zynq_ultra_ps_e_0_pl_clk0 [get_bd_pins s_axi_lite_aclk] \
  [get_bd_pins OFDM_Framer_0/axis_aclk] [get_bd_pins fec_hier_tx0/s_axi_lite_aclk] [get_bd_pins ssr_IFFT_0/s_axis_aclk]

current_bd_instance /tx0/fec_hier_tx0
connect_bd_intf_net [get_bd_intf_pins M_AXIS] [get_bd_intf_pins axis_subset_converter_3/M_AXIS]
connect_bd_intf_net [get_bd_intf_pins s_axis_fec_in] [get_bd_intf_pins axis_broadcaster_0/S_AXIS]
connect_bd_intf_net [get_bd_intf_pins S_AXI_FEC] [get_bd_intf_pins sd_fec_0/S_AXI]
connect_bd_intf_net [get_bd_intf_pins s_axi] [get_bd_intf_pins fec_controller_0/s_axi]
connect_bd_intf_net [get_bd_intf_pins axis_broadcaster_0/M00_AXIS] [get_bd_intf_pins fec_controller_0/s00_axis]
connect_bd_intf_net [get_bd_intf_pins axis_broadcaster_0/M01_AXIS] [get_bd_intf_pins axis_subset_converter_2/S_AXIS]
connect_bd_intf_net [get_bd_intf_pins axis_subset_converter_2/M_AXIS] [get_bd_intf_pins sd_fec_0/S_AXIS_DIN]
connect_bd_intf_net [get_bd_intf_pins fec_controller_0/m00_axis] [get_bd_intf_pins sd_fec_0/S_AXIS_CTRL]
connect_bd_intf_net [get_bd_intf_pins sd_fec_0/M_AXIS_DOUT] [get_bd_intf_pins axis_subset_converter_3/S_AXIS]
connect_bd_net [get_bd_pins axi_resetn] \
  [get_bd_pins axis_subset_converter_2/aresetn] [get_bd_pins sd_fec_0/reset_n] [get_bd_pins axis_subset_converter_3/aresetn] \
  [get_bd_pins axis_broadcaster_0/aresetn] [get_bd_pins fec_controller_0/axis_aresetn]
connect_bd_net [get_bd_pins core_clk] [get_bd_pins sd_fec_0/core_clk]
connect_bd_net [get_bd_pins s_axi_lite_aclk] \
  [get_bd_pins axis_broadcaster_0/aclk] [get_bd_pins axis_subset_converter_2/aclk] [get_bd_pins sd_fec_0/s_axi_aclk] \
  [get_bd_pins sd_fec_0/s_axis_ctrl_aclk] [get_bd_pins sd_fec_0/s_axis_din_aclk] [get_bd_pins sd_fec_0/m_axis_status_aclk] \
  [get_bd_pins sd_fec_0/m_axis_dout_aclk] [get_bd_pins axis_subset_converter_3/aclk] [get_bd_pins fec_controller_0/axis_aclk]

current_bd_instance /tx1
connect_bd_intf_net [get_bd_intf_pins s_axis_config] [get_bd_intf_pins OFDM_Framer_0/s_axis_config]
connect_bd_intf_net [get_bd_intf_pins S_AXI_FEC] [get_bd_intf_pins fec_hier_tx1/S_AXI_FEC]
connect_bd_intf_net [get_bd_intf_pins s_axi] [get_bd_intf_pins fec_hier_tx1/s_axi]
connect_bd_intf_net [get_bd_intf_pins s_axis_ctrl] [get_bd_intf_pins OFDM_Framer_0/s_axis_ctrl]
connect_bd_intf_net [get_bd_intf_pins OFDM_Framer_0/m_axis_data] [get_bd_intf_pins ssr_IFFT_0/s00_axis]
connect_bd_intf_net [get_bd_intf_pins fec_hier_tx1/M_AXIS] [get_bd_intf_pins OFDM_Framer_0/s_axis_data]
connect_bd_intf_net [get_bd_intf_pins s_axis_data] [get_bd_intf_pins fec_hier_tx1/s_axis_fec_in]
connect_bd_intf_net [get_bd_intf_pins m00_axis] [get_bd_intf_pins ssr_IFFT_0/m00_axis]
connect_bd_net [get_bd_pins axi_resetn] \
  [get_bd_pins OFDM_Framer_0/axis_aresetn] [get_bd_pins fec_hier_tx1/axi_resetn] [get_bd_pins ssr_IFFT_0/s_axis_aresetn]
connect_bd_net [get_bd_pins core_clk] [get_bd_pins fec_hier_tx1/core_clk]
connect_bd_net -net zynq_ultra_ps_e_0_pl_clk0 [get_bd_pins s_axi_lite_aclk] \
  [get_bd_pins OFDM_Framer_0/axis_aclk] [get_bd_pins fec_hier_tx1/s_axi_lite_aclk] [get_bd_pins ssr_IFFT_0/s_axis_aclk]

current_bd_instance /tx1/fec_hier_tx1
connect_bd_intf_net [get_bd_intf_pins M_AXIS] [get_bd_intf_pins axis_subset_converter_3/M_AXIS]
connect_bd_intf_net [get_bd_intf_pins s_axis_fec_in] [get_bd_intf_pins axis_broadcaster_0/S_AXIS]
connect_bd_intf_net [get_bd_intf_pins S_AXI_FEC] [get_bd_intf_pins sd_fec_0/S_AXI]
connect_bd_intf_net [get_bd_intf_pins s_axi] [get_bd_intf_pins fec_controller_0/s_axi]
connect_bd_intf_net [get_bd_intf_pins axis_broadcaster_0/M00_AXIS] [get_bd_intf_pins fec_controller_0/s00_axis]
connect_bd_intf_net [get_bd_intf_pins axis_broadcaster_0/M01_AXIS] [get_bd_intf_pins axis_subset_converter_2/S_AXIS]
connect_bd_intf_net [get_bd_intf_pins axis_subset_converter_2/M_AXIS] [get_bd_intf_pins sd_fec_0/S_AXIS_DIN]
connect_bd_intf_net [get_bd_intf_pins fec_controller_0/m00_axis] [get_bd_intf_pins sd_fec_0/S_AXIS_CTRL]
connect_bd_intf_net [get_bd_intf_pins sd_fec_0/M_AXIS_DOUT] [get_bd_intf_pins axis_subset_converter_3/S_AXIS]
connect_bd_net [get_bd_pins axi_resetn] \
  [get_bd_pins axis_subset_converter_2/aresetn] [get_bd_pins sd_fec_0/reset_n] [get_bd_pins axis_subset_converter_3/aresetn] \
  [get_bd_pins axis_broadcaster_0/aresetn] [get_bd_pins fec_controller_0/axis_aresetn]
connect_bd_net [get_bd_pins core_clk] [get_bd_pins sd_fec_0/core_clk]
connect_bd_net [get_bd_pins s_axi_lite_aclk] \
  [get_bd_pins axis_broadcaster_0/aclk] [get_bd_pins axis_subset_converter_2/aclk] [get_bd_pins sd_fec_0/s_axi_aclk] \
  [get_bd_pins sd_fec_0/s_axis_ctrl_aclk] [get_bd_pins sd_fec_0/s_axis_din_aclk] [get_bd_pins sd_fec_0/m_axis_status_aclk] \
  [get_bd_pins sd_fec_0/m_axis_dout_aclk] [get_bd_pins axis_subset_converter_3/aclk] [get_bd_pins fec_controller_0/axis_aclk]

current_bd_instance /hier_sync_tx
connect_bd_intf_net [get_bd_intf_pins S_AXIS3] [get_bd_intf_pins fifo_generator_3/S_AXIS]
connect_bd_intf_net [get_bd_intf_pins S_AXIS4] [get_bd_intf_pins fifo_generator_4/S_AXIS]
connect_bd_intf_net [get_bd_intf_pins M_AXIS3] [get_bd_intf_pins fifo_generator_3/M_AXIS]
connect_bd_intf_net [get_bd_intf_pins M_AXIS4] [get_bd_intf_pins fifo_generator_4/M_AXIS]
connect_bd_intf_net [get_bd_intf_pins S00_AXI] [get_bd_intf_pins smartconnect_5/S00_AXI]
connect_bd_intf_net [get_bd_intf_pins M03_AXI] [get_bd_intf_pins smartconnect_5/M03_AXI]
connect_bd_intf_net [get_bd_intf_pins M00_AXI] [get_bd_intf_pins smartconnect_5/M00_AXI]
connect_bd_intf_net [get_bd_intf_pins M01_AXI] [get_bd_intf_pins smartconnect_5/M01_AXI]
connect_bd_intf_net [get_bd_intf_pins M02_AXI] [get_bd_intf_pins smartconnect_5/M02_AXI]
connect_bd_intf_net [get_bd_intf_pins M_AXIS1] [get_bd_intf_pins fifo_generator_2/M_AXIS]
connect_bd_intf_net [get_bd_intf_pins S_AXIS2] [get_bd_intf_pins fifo_generator_0/S_AXIS]
connect_bd_intf_net [get_bd_intf_pins S_AXIS] [get_bd_intf_pins fifo_generator_1/S_AXIS]
connect_bd_intf_net [get_bd_intf_pins S_AXIS1] [get_bd_intf_pins fifo_generator_2/S_AXIS]
connect_bd_intf_net [get_bd_intf_pins M_AXIS2] [get_bd_intf_pins fifo_generator_0/M_AXIS]
connect_bd_intf_net [get_bd_intf_pins M_AXIS] [get_bd_intf_pins fifo_generator_1/M_AXIS]
connect_bd_net -net rst_ps8_0_249M_peripheral_aresetn [get_bd_pins s_aresetn] \
  [get_bd_pins fifo_generator_0/s_aresetn] [get_bd_pins fifo_generator_2/s_aresetn] [get_bd_pins fifo_generator_1/s_aresetn] \
  [get_bd_pins fifo_generator_4/s_aresetn] [get_bd_pins fifo_generator_3/s_aresetn] [get_bd_pins smartconnect_5/aresetn]
connect_bd_net -net usp_rf_data_converter_0_clk_dac1 [get_bd_pins m_aclk] \
  [get_bd_pins fifo_generator_0/m_aclk] [get_bd_pins fifo_generator_2/m_aclk] [get_bd_pins fifo_generator_1/m_aclk] \
  [get_bd_pins fifo_generator_4/m_aclk] [get_bd_pins fifo_generator_3/m_aclk] [get_bd_pins smartconnect_5/aclk1]
connect_bd_net -net zynq_ultra_ps_e_0_pl_clk0 [get_bd_pins s_aclk] \
  [get_bd_pins fifo_generator_0/s_aclk] [get_bd_pins fifo_generator_2/s_aclk] [get_bd_pins fifo_generator_1/s_aclk] \
  [get_bd_pins fifo_generator_4/s_aclk] [get_bd_pins fifo_generator_3/s_aclk] [get_bd_pins smartconnect_5/aclk]

current_bd_instance /reset_hier
connect_bd_net -net axi_resetn_1 [get_bd_pins rst_ps8_0_249M2/peripheral_aresetn] [get_bd_pins peripheral_aresetn2]
connect_bd_net -net clk_wiz_0_clk_out2 [get_bd_pins slowest_sync_clk] [get_bd_pins rst_ps8_0_249M1/slowest_sync_clk]
connect_bd_net [get_bd_pins rst_ps8_0_249M1/peripheral_aresetn] [get_bd_pins peripheral_aresetn]
connect_bd_net [get_bd_pins rst_ps8_0_249M3/peripheral_aresetn] [get_bd_pins peripheral_aresetn1]
connect_bd_net [get_bd_pins rst_ps8_0_249M/peripheral_aresetn] \
  [get_bd_pins ext_reset_in1] [get_bd_pins rst_ps8_0_249M2/ext_reset_in] [get_bd_pins rst_ps8_0_249M3/ext_reset_in]
connect_bd_net -net usp_rf_data_converter_0_clk_adc0 [get_bd_pins slowest_sync_clk2] [get_bd_pins rst_ps8_0_249M3/slowest_sync_clk]
connect_bd_net -net usp_rf_data_converter_0_clk_dac1 [get_bd_pins slowest_sync_clk3] [get_bd_pins rst_ps8_0_249M2/slowest_sync_clk]
connect_bd_net -net zynq_ultra_ps_e_0_pl_clk0 [get_bd_pins slowest_sync_clk1] [get_bd_pins rst_ps8_0_249M/slowest_sync_clk]
connect_bd_net -net zynq_ultra_ps_e_0_pl_resetn0 [get_bd_pins ext_reset_in] \
  [get_bd_pins rst_ps8_0_249M/ext_reset_in] [get_bd_pins rst_ps8_0_249M1/ext_reset_in]

current_bd_instance /hier_sync_rx
connect_bd_intf_net [get_bd_intf_pins M06_AXI2] [get_bd_intf_pins smartconnect_0/M06_AXI]
connect_bd_intf_net [get_bd_intf_pins M07_AXI2] [get_bd_intf_pins smartconnect_0/M07_AXI]
connect_bd_intf_net [get_bd_intf_pins M08_AXI] [get_bd_intf_pins smartconnect_0/M08_AXI]
connect_bd_intf_net [get_bd_intf_pins M09_AXI] [get_bd_intf_pins smartconnect_0/M09_AXI]
connect_bd_intf_net [get_bd_intf_pins M00_AXIS] [get_bd_intf_pins axis_broadcaster_1/M00_AXIS]
connect_bd_intf_net [get_bd_intf_pins M01_AXIS] [get_bd_intf_pins axis_broadcaster_1/M01_AXIS]
connect_bd_intf_net [get_bd_intf_pins axis_broadcaster_1/S_AXIS] [get_bd_intf_pins fifo_generator_6/M_AXIS]
connect_bd_intf_net [get_bd_intf_pins S_AXIS1] [get_bd_intf_pins fifo_generator_6/S_AXIS]
connect_bd_intf_net [get_bd_intf_pins S00_AXI1] [get_bd_intf_pins smartconnect_4/S00_AXI]
connect_bd_intf_net [get_bd_intf_pins S00_AXI] [get_bd_intf_pins smartconnect_0/S00_AXI]
connect_bd_intf_net [get_bd_intf_pins M00_AXI] [get_bd_intf_pins smartconnect_0/M00_AXI]
connect_bd_intf_net [get_bd_intf_pins M01_AXI] [get_bd_intf_pins smartconnect_0/M01_AXI]
connect_bd_intf_net [get_bd_intf_pins M02_AXI] [get_bd_intf_pins smartconnect_0/M02_AXI]
connect_bd_intf_net [get_bd_intf_pins M03_AXI] [get_bd_intf_pins smartconnect_0/M03_AXI]
connect_bd_intf_net [get_bd_intf_pins M06_AXI] [get_bd_intf_pins smartconnect_0/M04_AXI]
connect_bd_intf_net [get_bd_intf_pins M07_AXI] [get_bd_intf_pins smartconnect_0/M05_AXI]
connect_bd_intf_net [get_bd_intf_pins M02_AXI1] [get_bd_intf_pins smartconnect_4/M00_AXI]
connect_bd_intf_net [get_bd_intf_pins M03_AXI1] [get_bd_intf_pins smartconnect_4/M01_AXI]
connect_bd_intf_net [get_bd_intf_pins M04_AXI1] [get_bd_intf_pins smartconnect_4/M02_AXI]
connect_bd_intf_net [get_bd_intf_pins M05_AXI1] [get_bd_intf_pins smartconnect_4/M03_AXI]
connect_bd_intf_net [get_bd_intf_pins M06_AXI1] [get_bd_intf_pins smartconnect_4/M04_AXI]
connect_bd_intf_net [get_bd_intf_pins M07_AXI1] [get_bd_intf_pins smartconnect_4/M05_AXI]
connect_bd_net -net rst_ps8_0_249M3_peripheral_aresetn [get_bd_pins aresetn1] [get_bd_pins axis_broadcaster_1/aresetn]
connect_bd_net -net rst_ps8_0_249M_peripheral_aresetn [get_bd_pins aresetn] \
  [get_bd_pins smartconnect_0/aresetn] [get_bd_pins smartconnect_4/aresetn] [get_bd_pins fifo_generator_6/s_aresetn]
connect_bd_net -net usp_rf_data_converter_0_clk_adc0 [get_bd_pins aclk] \
  [get_bd_pins axis_broadcaster_1/aclk] [get_bd_pins smartconnect_0/aclk1] [get_bd_pins smartconnect_4/aclk1] \
  [get_bd_pins fifo_generator_6/m_aclk]
connect_bd_net -net zynq_ultra_ps_e_0_pl_clk0 [get_bd_pins aclk1] \
  [get_bd_pins smartconnect_0/aclk] [get_bd_pins smartconnect_4/aclk] [get_bd_pins fifo_generator_6/s_aclk]

current_bd_instance /
connect_bd_intf_net [get_bd_intf_ports CLK_IN1_D] [get_bd_intf_pins clk_wiz_0/CLK_IN1_D]
connect_bd_intf_net [get_bd_intf_pins system_ila_0/SLOT_0_AXIS] [get_bd_intf_pins rx1/m_axis1]
connect_bd_intf_net [get_bd_intf_pins system_ila_0/SLOT_1_AXIS] [get_bd_intf_pins rx1/m00_axis]
connect_bd_intf_net [get_bd_intf_pins system_ila_0/SLOT_2_AXIS] [get_bd_intf_pins rx1/s00_axis]
connect_bd_intf_net [get_bd_intf_pins system_ila_0/SLOT_4_AXIS] [get_bd_intf_pins rx1/m_axis2]
connect_bd_intf_net [get_bd_intf_pins hier_sync_rx/S00_AXI1] [get_bd_intf_pins ps8_0_axi_periph_1/M00_AXI]
connect_bd_intf_net [get_bd_intf_pins hier_sync_tx/S00_AXI] [get_bd_intf_pins ps8_0_axi_periph_1/M01_AXI]
connect_bd_intf_net [get_bd_intf_pins hier_sync_rx/S00_AXI] [get_bd_intf_pins ps8_0_axi_periph_1/M03_AXI]
connect_bd_intf_net [get_bd_intf_pins tx1/S_AXI_FEC] [get_bd_intf_pins hier_sync_tx/M01_AXI]
connect_bd_intf_net [get_bd_intf_pins dmas_tx/S_AXI_LITE1] [get_bd_intf_pins axi_smc_2/M01_AXI]
connect_bd_intf_net [get_bd_intf_pins dmas_rx/S_AXI_LITE1] [get_bd_intf_pins axi_smc_2/M05_AXI]
connect_bd_intf_net [get_bd_intf_pins dmas_tx/S_AXI_LITE2] [get_bd_intf_pins axi_smc_2/M02_AXI]
connect_bd_intf_net [get_bd_intf_pins dmas_tx/S_AXI_LITE3] [get_bd_intf_pins axi_smc_2/M03_AXI]
connect_bd_intf_net [get_bd_intf_pins dmas_tx/S_AXI_LITE4] [get_bd_intf_pins axi_smc_2/M04_AXI]
connect_bd_intf_net [get_bd_intf_pins dmas_tx/S_AXI_LITE6] [get_bd_intf_pins axi_smc_2/M06_AXI]
connect_bd_intf_net [get_bd_intf_pins dmas_tx/S_AXI_LITE] [get_bd_intf_pins axi_smc_2/M00_AXI]
connect_bd_intf_net [get_bd_intf_ports adc0_clk] [get_bd_intf_pins usp_rf_data_converter_0/adc0_clk]
connect_bd_intf_net [get_bd_intf_pins iq_interleaver_gain_0/m00_axis] [get_bd_intf_pins axis_broadcaster_2/S_AXIS]
connect_bd_intf_net [get_bd_intf_pins iq_interleaver_gain_1/m00_axis] [get_bd_intf_pins axis_broadcaster_3/S_AXIS]
connect_bd_intf_net [get_bd_intf_pins hier_sync_tx/M_AXIS1] [get_bd_intf_pins tx0/s_axis_fec_in]
connect_bd_intf_net [get_bd_intf_pins dmas_tx/M_AXI_MM2S6] [get_bd_intf_pins axi_smc/S01_AXI]
connect_bd_intf_net [get_bd_intf_pins dmas_tx/M_AXI_SG6] [get_bd_intf_pins axi_smc/S00_AXI]
connect_bd_intf_net [get_bd_intf_pins dmas_tx/M_AXI_MM2S] [get_bd_intf_pins axi_smc/S02_AXI]
connect_bd_intf_net [get_bd_intf_pins dmas_tx/M_AXI_SG] [get_bd_intf_pins axi_smc/S03_AXI]
connect_bd_intf_net [get_bd_intf_pins dmas_tx/M_AXI_MM2S1] [get_bd_intf_pins axi_smc/S04_AXI]
connect_bd_intf_net [get_bd_intf_pins dmas_tx/M_AXI_SG1] [get_bd_intf_pins axi_smc/S05_AXI]
connect_bd_intf_net [get_bd_intf_pins dmas_tx/M_AXI_MM2S2] [get_bd_intf_pins axi_smc/S06_AXI]
connect_bd_intf_net [get_bd_intf_pins dmas_tx/M_AXI_SG2] [get_bd_intf_pins axi_smc/S09_AXI]
connect_bd_intf_net [get_bd_intf_pins dmas_rx/M_AXI_S2MM] [get_bd_intf_pins axi_smc/S07_AXI]
connect_bd_intf_net [get_bd_intf_pins dmas_rx/M_AXI_SG] [get_bd_intf_pins axi_smc/S08_AXI]
connect_bd_intf_net [get_bd_intf_pins dmas_rx/M_AXI_S2MM1] [get_bd_intf_pins axi_smc/S10_AXI]
connect_bd_intf_net [get_bd_intf_pins dmas_rx/M_AXI_SG1] [get_bd_intf_pins axi_smc/S11_AXI]
connect_bd_intf_net [get_bd_intf_pins dmas_tx/M_AXI_MM2S3] [get_bd_intf_pins axi_smc_1/S01_AXI]
connect_bd_intf_net [get_bd_intf_pins dmas_tx/M_AXI_SG3] [get_bd_intf_pins axi_smc_1/S00_AXI]
connect_bd_intf_net [get_bd_intf_pins dmas_tx/M_AXI_MM2S4] [get_bd_intf_pins axi_smc_1/S02_AXI]
connect_bd_intf_net [get_bd_intf_pins dmas_tx/M_AXI_SG4] [get_bd_intf_pins axi_smc_1/S03_AXI]
connect_bd_intf_net [get_bd_intf_pins dmas_tx/M_AXI_MM2S5] [get_bd_intf_pins axi_smc_1/S04_AXI]
connect_bd_intf_net [get_bd_intf_pins dmas_tx/M_AXI_SG5] [get_bd_intf_pins axi_smc_1/S05_AXI]
connect_bd_intf_net [get_bd_intf_pins axi_smc_1/M00_AXI] [get_bd_intf_pins zynq_ultra_ps_e_0/S_AXI_HPC1_FPD]
connect_bd_intf_net [get_bd_intf_pins axi_smc_2/M07_AXI] [get_bd_intf_pins dmas_rx/S_AXI_LITE]
connect_bd_intf_net [get_bd_intf_pins axi_smc/M00_AXI] [get_bd_intf_pins zynq_ultra_ps_e_0/S_AXI_HPC0_FPD]
connect_bd_intf_net [get_bd_intf_pins axis_broadcaster_0/M00_AXIS] [get_bd_intf_pins tx0/s_axis_config]
connect_bd_intf_net [get_bd_intf_pins axis_broadcaster_0/M01_AXIS] [get_bd_intf_pins tx1/s_axis_config]
connect_bd_intf_net [get_bd_intf_pins hier_sync_rx/M00_AXIS] [get_bd_intf_pins rx1/S_AXIS1]
connect_bd_intf_net [get_bd_intf_pins hier_sync_rx/M01_AXIS] [get_bd_intf_pins rx0/S_AXIS1]
connect_bd_intf_net [get_bd_intf_pins axis_broadcaster_2/M00_AXIS] [get_bd_intf_pins rx1/S_AXIS]
connect_bd_intf_net [get_bd_intf_pins axis_broadcaster_2/M00_AXIS] [get_bd_intf_pins system_ila_0/SLOT_5_AXIS]
connect_bd_intf_net [get_bd_intf_pins axis_broadcaster_2/M01_AXIS] [get_bd_intf_pins signal_detect_0/s_axis]
connect_bd_intf_net [get_bd_intf_pins axis_broadcaster_3/M00_AXIS] [get_bd_intf_pins rx0/S_AXIS]
connect_bd_intf_net [get_bd_intf_pins axis_broadcaster_3/M01_AXIS] [get_bd_intf_pins signal_detect_1/s_axis]
connect_bd_intf_net [get_bd_intf_ports dac1_clk] [get_bd_intf_pins usp_rf_data_converter_0/dac1_clk]
connect_bd_intf_net [get_bd_intf_pins dmas_tx/M_AXIS_MM2S] [get_bd_intf_pins hier_sync_tx/S_AXIS2]
connect_bd_intf_net [get_bd_intf_pins dmas_tx/M_AXIS_MM2S2] [get_bd_intf_pins hier_sync_tx/S_AXIS3]
connect_bd_intf_net [get_bd_intf_pins dmas_tx/M_AXIS_MM2S3] [get_bd_intf_pins hier_sync_tx/S_AXIS]
connect_bd_intf_net [get_bd_intf_pins dmas_tx/M_AXIS_MM2S4] [get_bd_intf_pins hier_sync_tx/S_AXIS4]
connect_bd_intf_net [get_bd_intf_pins dmas_tx/M_AXIS_MM2S1] [get_bd_intf_pins hier_sync_rx/S_AXIS1]
connect_bd_intf_net [get_bd_intf_pins dmas_tx/M_AXIS_MM2S6] [get_bd_intf_pins hier_sync_tx/S_AXIS1]
connect_bd_intf_net [get_bd_intf_pins hier_sync_tx/M_AXIS2] [get_bd_intf_pins axis_broadcaster_0/S_AXIS]
connect_bd_intf_net [get_bd_intf_pins hier_sync_tx/M_AXIS] [get_bd_intf_pins tx0/s_axis_framer_ctrl]
connect_bd_intf_net [get_bd_intf_pins iq_interleaver_gain_0/s_axi] [get_bd_intf_pins hier_sync_rx/M08_AXI]
connect_bd_intf_net [get_bd_intf_pins iq_interleaver_gain_1/s_axi] [get_bd_intf_pins hier_sync_rx/M09_AXI]
connect_bd_intf_net [get_bd_intf_pins usp_rf_data_converter_0/s_axi] [get_bd_intf_pins ps8_0_axi_periph_1/M02_AXI]
connect_bd_intf_net [get_bd_intf_pins rx0/m00_axis] [get_bd_intf_pins dmas_rx/S_AXIS1]
connect_bd_intf_net [get_bd_intf_pins rx1/M_AXIS] [get_bd_intf_pins dmas_rx/S_AXIS]
connect_bd_intf_net [get_bd_intf_pins rx1/M_AXIS] [get_bd_intf_pins system_ila_0/SLOT_3_AXIS]
connect_bd_intf_net [get_bd_intf_pins rx0/s_axi1] [get_bd_intf_pins hier_sync_rx/M06_AXI1]
connect_bd_intf_net [get_bd_intf_pins rx1/s_axi1] [get_bd_intf_pins hier_sync_rx/M06_AXI]
connect_bd_intf_net [get_bd_intf_pins rx0/s_axi] [get_bd_intf_pins hier_sync_rx/M05_AXI1]
connect_bd_intf_net [get_bd_intf_pins rx1/s_axi] [get_bd_intf_pins hier_sync_rx/M00_AXI]
connect_bd_intf_net [get_bd_intf_pins tx1/s_axi] [get_bd_intf_pins hier_sync_tx/M02_AXI]
connect_bd_intf_net [get_bd_intf_pins tx0/s_axi_fec] [get_bd_intf_pins hier_sync_tx/M03_AXI]
connect_bd_intf_net [get_bd_intf_pins rx1/s_axi_fec] [get_bd_intf_pins hier_sync_rx/M01_AXI]
connect_bd_intf_net [get_bd_intf_pins rx0/s_axi_fec] [get_bd_intf_pins hier_sync_rx/M02_AXI1]
connect_bd_intf_net [get_bd_intf_pins rx1/s_axi_fec_ctrl] [get_bd_intf_pins hier_sync_rx/M02_AXI]
connect_bd_intf_net [get_bd_intf_pins rx0/s_axi_fec_ctrl] [get_bd_intf_pins hier_sync_rx/M03_AXI1]
connect_bd_intf_net [get_bd_intf_pins tx0/s_axi_fec_ctrl] [get_bd_intf_pins hier_sync_tx/M00_AXI]
connect_bd_intf_net [get_bd_intf_pins rx1/s_axi_tlast0] [get_bd_intf_pins hier_sync_rx/M03_AXI]
